# EAGLE design control (EAGLE 9.6.2)
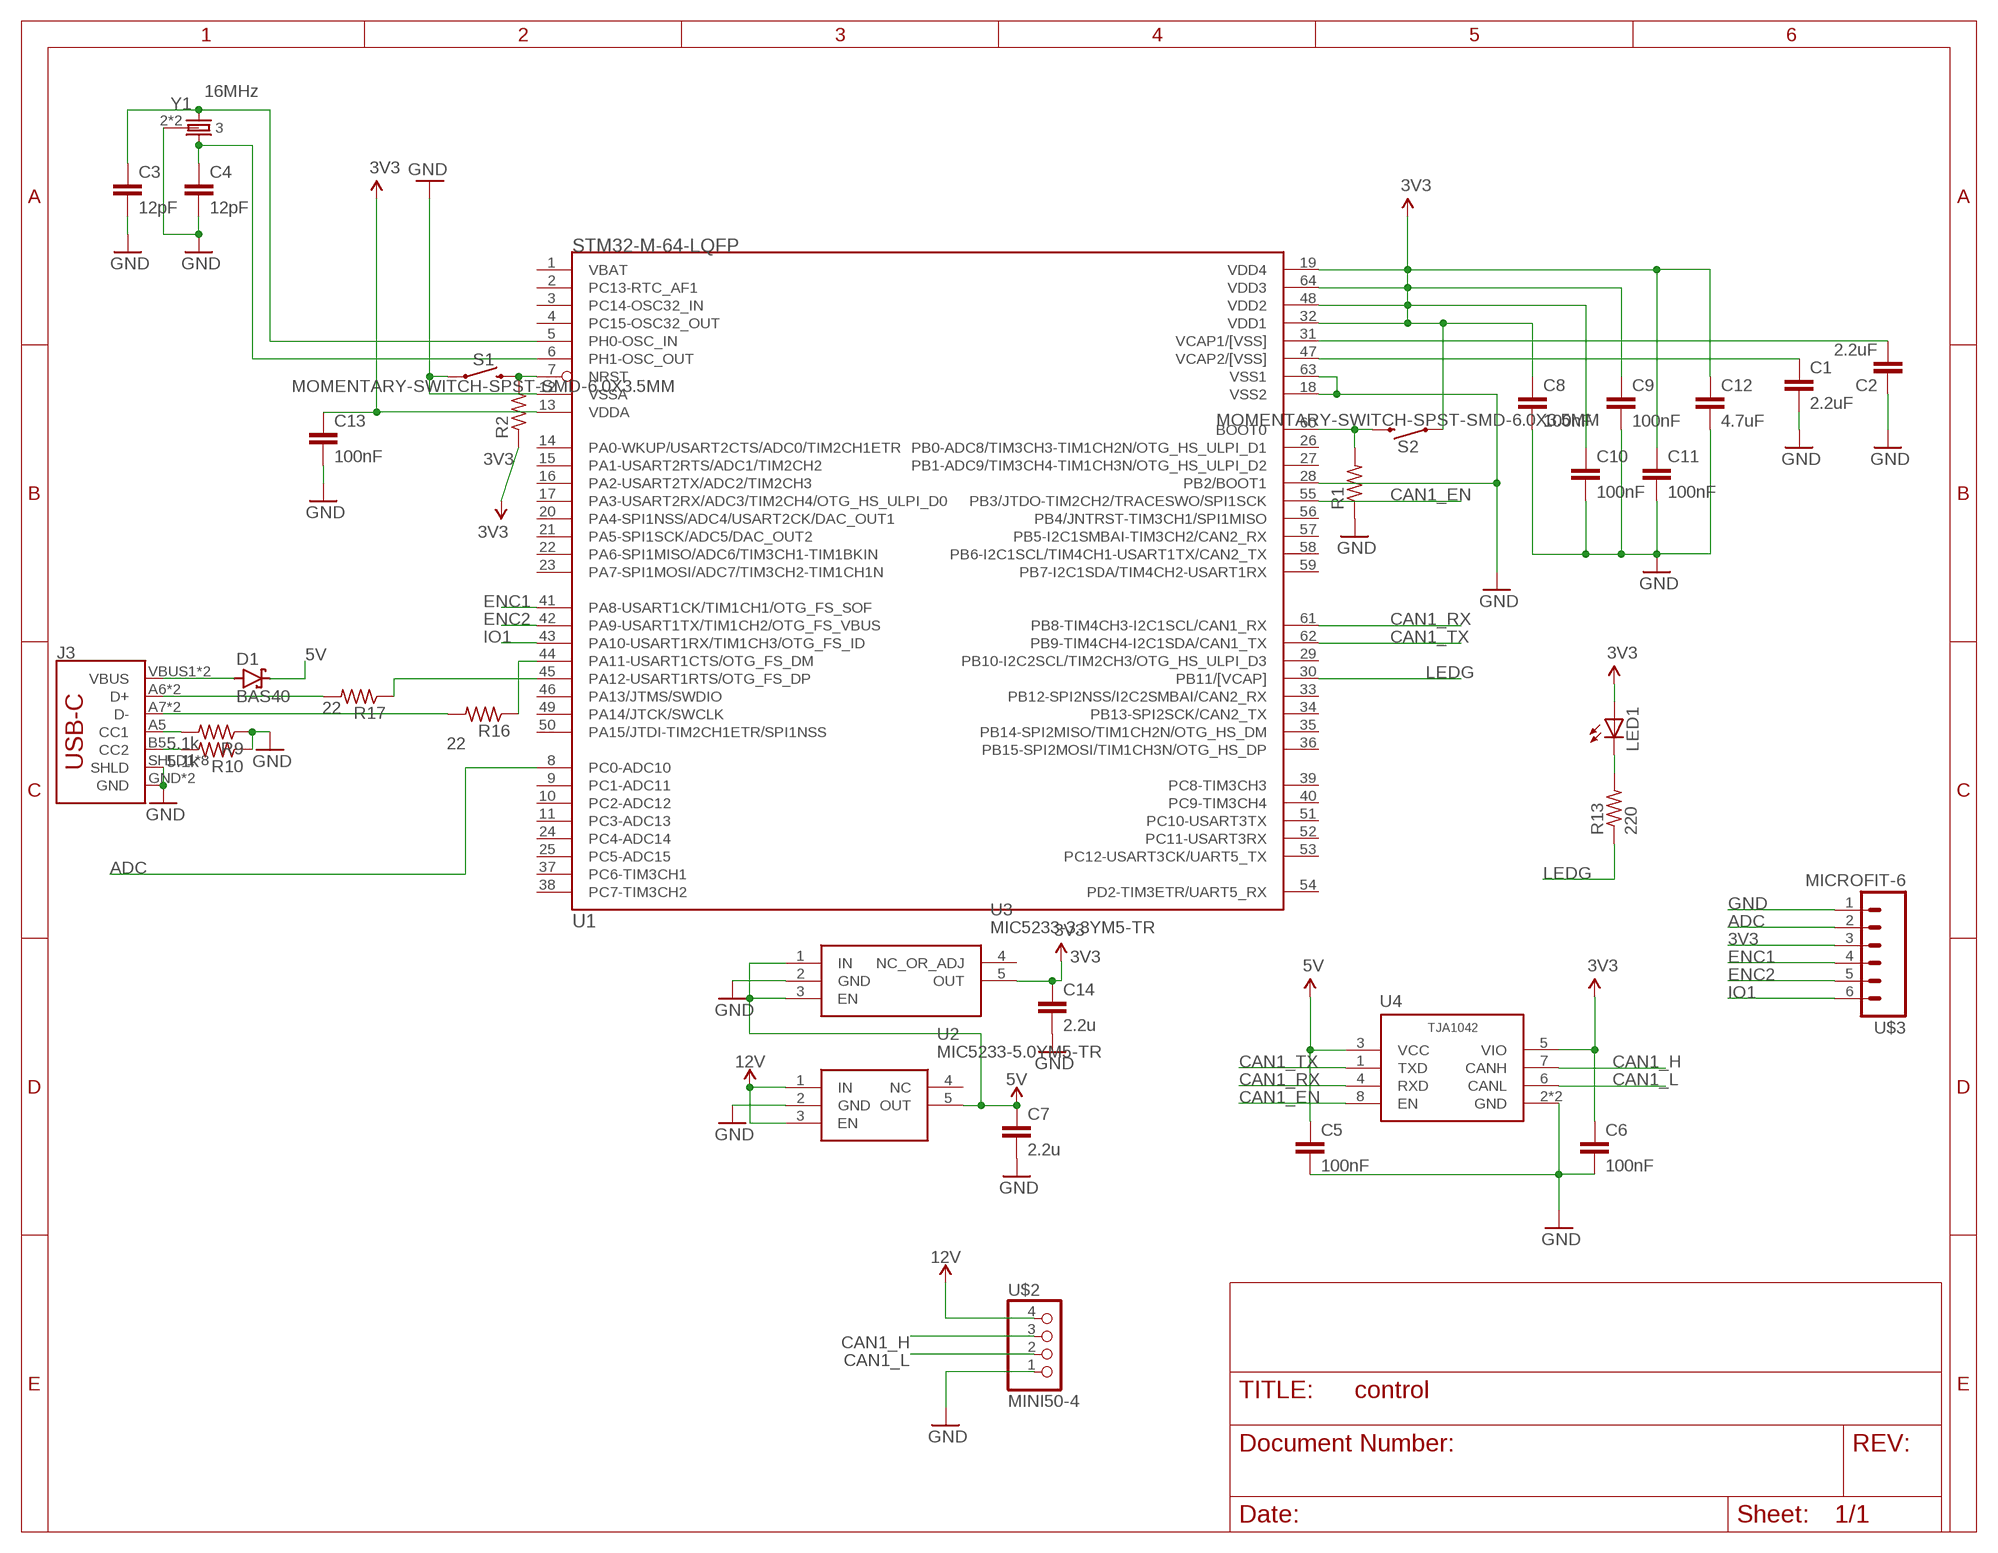
[diagram p0: schematic, sheet 1]

## Parts
C1  2.2uF  C0603  [0603-C]
C2  2.2uF  C0603  [0603-C]
C3  12pF  C0603  [0603-C]
C4  12pF  C0603  [0603-C]
C5  100nF  C0603  [0603-C]
C6  100nF  C0603  [0603-C]
C7  2.2u  C-EUC0603  [C0603]
C8  100nF  C0603  [0603-C]
C9  100nF  C0603  [0603-C]
C10  100nF  C0603  [0603-C]
C11  100nF  C0603  [0603-C]
C12  4.7uF  C0603  [0603-C]
C13  100nF  C0603  [0603-C]
C14  2.2u  C-EUC0603  [C0603]
D1  BAS40  [SOT23]
J3  USB-C-BREAKOUT_SPARKFUN-CONNECTORS_USB_C16PIN  [USB-C-BREAKOUT_SPARKFUN-CONNECTORS_USB-C-16P]
LED1  LEDCHIPLED_0805  [CHIPLED_0805]
R1  R0402  [0402-R]
R2  R0402  [0402-R]
R9  5.1k  R0402  [0402-R]
R10  5.1k  R0402  [0402-R]
R13  220  R0402  [0402-R]
R16  22  R0402  [0402-R]
R17  22  R0402  [0402-R]
S1  MOMENTARY-SWITCH-SPST-SMD-6.0X3.5MM  [TACTILE_SWITCH_SMD_6.0X3.5MM]
S2  MOMENTARY-SWITCH-SPST-SMD-6.0X3.5MM  [TACTILE_SWITCH_SMD_6.0X3.5MM]
U1  STM32-M-64-LQFP  [LQFP64]
U2  MIC5233-5.0YM5-TR  [SOT95P280X145-5N]
U3  MIC5233-3.3YM5-TR  [SOT95P280X145-5N]
U4  TJA1042HVSON  [HVSON8]
U$2  MINI50-4  [MINI50]
U$3  MICROFIT-6  [MICROFIT-6]
Y1  16MHz  CRYSTAL-3.2X2.54-PIN  [XTAL-3.2X2.5]

## Nets
3V3: C6.1 C8.1 C9.1 C10.1 C11.1 C12.1 C13.1 C14.1 LED1.A R2.1 S2.1 U1.13(VDDA) U1.19(VDD4) U1.32(VDD1) U1.48(VDD2) U1.64(VDD3) U3.5(OUT) U4.5(VIO) U$3.3
5V: C5.1 C7.1 D1.3(C) U2.5(OUT) U3.1(IN) U3.3(EN) U4.3(VCC)
12V: U2.1(IN) U2.3(EN) U$2.4
ADC: U1.8(PC0-ADC10) U$3.2
CAN1_EN: U1.55(PB3/JTDO-TIM2CH2/TRACESWO/SPI1SCK) U4.8(EN)
CAN1_H: U4.7(CANH) U$2.3
CAN1_L: U4.6(CANL) U$2.2
CAN1_RX: U1.61(PB8-TIM4CH3-I2C1SCL/CAN1_RX) U4.4(RXD)
CAN1_TX: U1.62(PB9-TIM4CH4-I2C1SDA/CAN1_TX) U4.1(TXD)
ENC1: U1.41(PA8-USART1CK/TIM1CH1/OTG_FS_SOF) U$3.4
ENC2: U1.42(PA9-USART1TX/TIM1CH2/OTG_FS_VBUS) U$3.5
GND: C1.2 C2.1 C3.2 C4.2 C5.2 C6.2 C7.2 C8.2 C9.2 C10.2 C11.2 C12.2 C13.2 C14.2 J3.GND J3.GND2(GND) J3.SHLD1(SHLD) J3.SHLD2(SHLD) J3.SHLD3(SHLD) J3.SHLD4(SHLD) J3.SHLD5(SHLD) J3.SHLD6(SHLD) J3.SHLD7(SHLD) J3.SHLD8(SHLD) R1.1 R9.1 R10.1 S1.1 U1.12(VSSA) U1.18(VSS2) U1.28(PB2/BOOT1) U1.63(VSS1) U2.2(GND) U3.2(GND) U4.2(GND) U4.PAD(GND) U$2.1 U$3.1 Y1.2 Y1.4
IO1: U1.43(PA10-USART1RX/TIM1CH3/OTG_FS_ID) U$3.6
LEDG: R13.1 U1.30(PB11/[VCAP])
N$1: C3.1 U1.5(PH0-OSC_IN) Y1.1
N$2: R16.1 U1.44(PA11-USART1CTS/OTG_FS_DM)
N$3: C4.1 U1.6(PH1-OSC_OUT) Y1.3
N$4: R17.1 U1.45(PA12-USART1RTS/OTG_FS_DP)
N$5: J3.A7(D-) J3.B7(D-) R16.2
N$6: J3.A6(D+) J3.B6(D+) R17.2
N$7: R1.2 S2.2 U1.60(BOOT0)
N$8: J3.A5(CC1) R9.2
N$9: J3.B5(CC2) R10.2
N$10: R2.2 S1.2 U1.7(NRST)
N$11: D1.1(A) J3.VBUS1(VBUS) J3.VBUS2(VBUS)
N$26: LED1.C R13.2
VCAP1: C2.2 U1.31(VCAP1/[VSS])
VCAP2: C1.1 U1.47(VCAP2/[VSS])
Unconnected: U1.1(VBAT) U1.2(PC13-RTC_AF1) U1.3(PC14-OSC32_IN) U1.4(PC15-OSC32_OUT) U1.9(PC1-ADC11) U1.10(PC2-ADC12) U1.11(PC3-ADC13) U1.14(PA0-WKUP/USART2CTS/ADC0/TIM2CH1ETR) U1.15(PA1-USART2RTS/ADC1/TIM2CH2) U1.16(PA2-USART2TX/ADC2/TIM2CH3) U1.17(PA3-USART2RX/ADC3/TIM2CH4/OTG_HS_ULPI_D0) U1.20(PA4-SPI1NSS/ADC4/USART2CK/DAC_OUT1) U1.21(PA5-SPI1SCK/ADC5/DAC_OUT2) U1.22(PA6-SPI1MISO/ADC6/TIM3CH1-TIM1BKIN) U1.23(PA7-SPI1MOSI/ADC7/TIM3CH2-TIM1CH1N) U1.24(PC4-ADC14) U1.25(PC5-ADC15) U1.26(PB0-ADC8/TIM3CH3-TIM1CH2N/OTG_HS_ULPI_D1) U1.27(PB1-ADC9/TIM3CH4-TIM1CH3N/OTG_HS_ULPI_D2) U1.29(PB10-I2C2SCL/TIM2CH3/OTG_HS_ULPI_D3) U1.33(PB12-SPI2NSS/I2C2SMBAI/CAN2_RX) U1.34(PB13-SPI2SCK/CAN2_TX) U1.35(PB14-SPI2MISO/TIM1CH2N/OTG_HS_DM) U1.36(PB15-SPI2MOSI/TIM1CH3N/OTG_HS_DP) U1.37(PC6-TIM3CH1) U1.38(PC7-TIM3CH2) U1.39(PC8-TIM3CH3) U1.40(PC9-TIM3CH4) U1.46(PA13/JTMS/SWDIO) U1.49(PA14/JTCK/SWCLK) U1.50(PA15/JTDI-TIM2CH1ETR/SPI1NSS) U1.51(PC10-USART3TX) U1.52(PC11-USART3RX) U1.53(PC12-USART3CK/UART5_TX) U1.54(PD2-TIM3ETR/UART5_RX) U1.56(PB4/JNTRST-TIM3CH1/SPI1MISO) U1.57(PB5-I2C1SMBAI-TIM3CH2/CAN2_RX) U1.58(PB6-I2C1SCL/TIM4CH1-USART1TX/CAN2_TX) U1.59(PB7-I2C1SDA/TIM4CH2-USART1RX) U2.4(NC) U3.4(NC_OR_ADJ)

## Library data of the parts
C1-C6 C8-C13 = comma.ai:C
C7 C14 = rcl:C-EU: CAPACITOR, European symbol; SPICEPREFIX: C
D1 = diode:BAS40: Silicon Schottky Diodes General-purpose diode for high-speed switching
J3 = ROTR-Wireless:USB-C-BREAKOUT_SPARKFUN-CONNECTORS_USB_C: USB Type C 16Pin Connector Super Speed pins not available on the 16-pin purely SMD connector so this part is best for USB 2.0 implementations. D1 and D2 are tied together enabling D+/- no matter which way the cable is plugged into the connector. The two channel configuration pins (CC1/2) are exposed. These are normally connected to ground via 5.1k resistors but can be reconfigured for high current/high power applications.; PROD_ID: CONN-14122
LED1 = adafruit:LED: LED OSRAM: - CHIPLED LG R971, LG N971, LY N971, LG Q971, LY Q971, LO R971, LY R971 LH N974, LH R974 LS Q976, LO Q976, LY Q976 LO Q996 - Hyper CHIPLED LW Q18S LB Q993, LB Q99A, LB R99A - SideLED LS A670, LO A670, LY A670, LG A670, LP A670 LB A673, LV A673, LT A673, LW A673 LH A674 LY A675 LS A676, LA A676, LO A676, LY A676, LW A676 LS A679, LY A679, LG A679 - Hyper Micro SIDELED® LS Y876, LA Y876, LO Y876, LY Y876 LT Y87S - SmartLED LW L88C, LW L88S LB L89C, LB L89S, LG L890 LS L89K, LO L89K, LY L89K LS L896, LA L896, LO L896, LY L896 - TOPLED LS T670, LO T670, LY T670, LG T670, LP T670 LSG T670, LSP T670, LSY T670, LOP T670, LYG T670 LG T671, LOG T671, LSG T671 LB T673, LV T673, LT T673, LW T673 LH T674 LS T676, LA T676, LO T676, LY T676, LB T676, LH T676, LSB T676, LW T676 LB T67C, LV T67C, LT T67C, LS T67K, LO T67K, LY T67K, LW E67C LS E67B, LA E67B, LO E67B, LY E67B, LB E67C, LV E67C, LT E67C LW T67C LS T679, LY T679, LG T679 LS T770, LO T770, LY T770, LG T770, LP T770 LB T773, LV T773, LT T773, LW T773 LH T774 LS E675, LA E675, LY E675, LS T675 LS T776, LA T776, LO T776, LY T776, LB T776 LHGB T686 LT T68C, LB T68C - Hyper Mini TOPLED® LB M676 - Mini TOPLED Santana® LG M470 LS M47K, LO M47K, LY M47K Source: http://www.osram.convergy.de/
R1 R2 R9 R10 R13 R16 R17 = comma.ai:R
S1 S2 = SparkFun-Switches:MOMENTARY-SWITCH-SPST: Momentary Switch (Pushbutton) - SPST Normally-open (NO) SPST momentary switches (buttons, pushbuttons). Variants PTH-12MM - 12mm square, through-hole Momentary Pushbutton Switch - 12mm Square <https://www.sparkfun.com/products/9190> (COM-09190) PTH-6.0MM, PTH-6.0MM-KIT - 6.0mm square, through-hole Mini Pushbutton Switch <https://www.sparkfun.com/products/97> (COM-00097) KIT package intended for soldering kit's - only one side of pads' copper is exposed. PTH-RIGHT-ANGLE-KIT - Right-angle, through-hole Right Angle Tactile Button <https://www.sparkfun.com/products/10791> - Used on SparkFun BigTime Watch Kit <https://www.sparkfun.com/products/11734> SMD-12MM - 12mm square, surface-mount Tactile Button - SMD (12mm) <https://www.sparkfun.com/products/12993> (COM-12993) Used on SparkFun PicoBoard <https://www.sparkfun.com/products/11888> SMD-4.5MM - 4.5mm Square Trackball Switch Used on SparkFun Blackberry Trackballer Breakout <https://www.sparkfun.com/products/13169> SMD-4.6MMX2.8MM - 4.60mm x 2.80mm, surface mount Used on SparkFun SAMD21 Mini Breakout <https://www.sparkfun.com/products/13664> SMD-5.2MM, SMD-5.2-REDUNDANT - 5.2mm square, surface-mount Mini Pushbutton Switch - SMD <https://www.sparkfun.com/products/8720> (COM-08720) Used on Arduino Pro Mini <https://www.sparkfun.com/products/11114> REDUNDANT package connects both switch circuits together SMD-6.0X3.5MM - 6.0 x 3.5mm, surface mount Momentary Reset Switch SMD <https://www.sparkfun.com/products/8229> (COM-08229) SMD-6.2MM-TALL - 6.2mm square, surface mount Tactile Button - SMD (6mm) <https://www.sparkfun.com/products/12992> Used on SparkFun Digital Sandbox <https://www.sparkfun.com/products/12651> SMD-RIGHT-ANGLE - Right-angle, surface mount Used on SparkFun Block for Intel® Edison - Arduino <https://www.sparkfun.com/products/13036>; PROD_ID: SWCH-00815; SF_SKU: COM-08229
U1 = comma.ai:STM32-M-64-LQFP: STM32F103 Medium Density 64pin LQFP
U2 = SamacSys_Parts:MIC5233-5.0YM5-TR: MICROCHIP - MIC5233-5.0YM5-TR - LDO, REG, 36VIN, 0.1A, 5V, 2%, 5SOT23 Source: Datasheet <https://componentsearchengine.com/Datasheets/2/MIC5233-5.0YM5-TR.pdf>; DESCRIPTION: MICROCHIP - MIC5233-5.0YM5-TR - LDO, REG, 36VIN, 0.1A, 5V, 2%, 5SOT23; HEIGHT: 1.45mm; MANUFACTURER_NAME: Microchip; MANUFACTURER_PART_NUMBER: MIC5233-5.0YM5-TR; MOUSER_PART_NUMBER: 998-MIC5233-5.0YM5TR; MOUSER_PRICE-STOCK: https://www.mouser.co.uk/ProductDetail/Microchip-Technology-Micrel/MIC5233-50YM5-TR?qs=U6T8BxXiZAWSnpCHgrMajw%3D%3D
U3 = SamacSys_Parts:MIC5233-3.3YM5-TR: High Input Voltage Low IQ UCAP LDO Regulator Source: Datasheet <http://ww1.microchip.com/downloads/en/DeviceDoc/MIC5233-Data-Sheet-DS20006033D.pdf>; DESCRIPTION: High Input Voltage Low IQ UCAP LDO Regulator; HEIGHT: 1.45mm; MANUFACTURER_NAME: Microchip; MANUFACTURER_PART_NUMBER: MIC5233-3.3YM5-TR; MOUSER_PART_NUMBER: 998-MIC5233-3.3YM5TR; MOUSER_PRICE-STOCK: https://www.mouser.co.uk/ProductDetail/Microchip-Technology-Micrel/MIC5233-33YM5-TR?qs=U6T8BxXiZAWDhshLMgpaLQ%3D%3D
U4 = comma.ai:TJA1042
U$2 = interceptor:MINI50-4
U$3 = interceptor:MICROFIT-6
Y1 = comma.ai:CRYSTAL-3.2X2.5

## Board
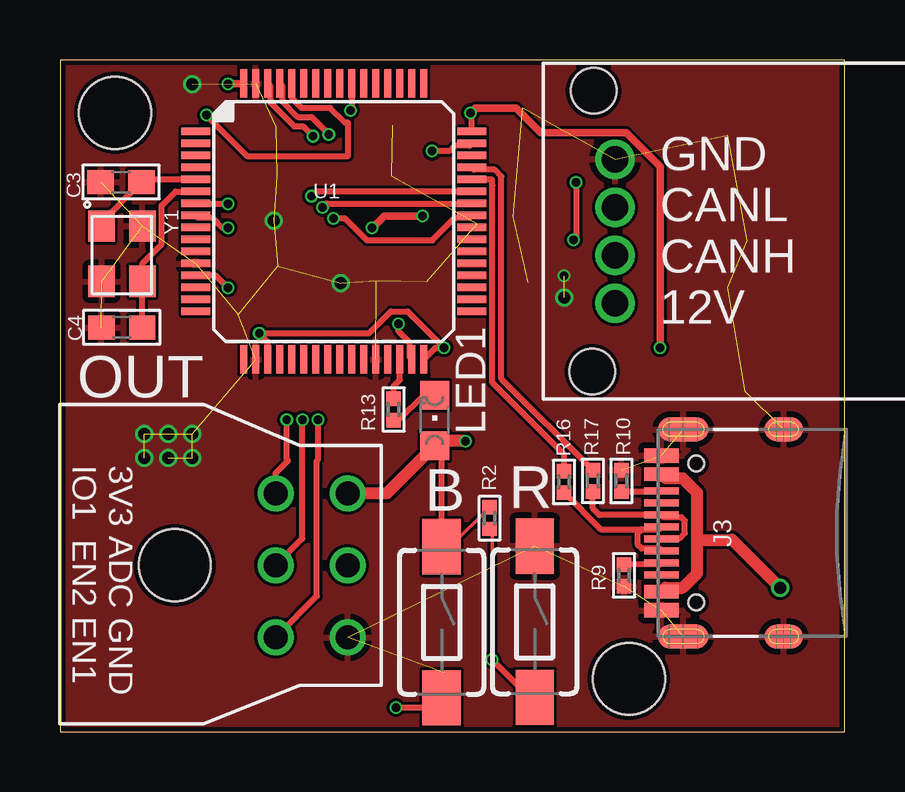
[diagram p1: board, top side]
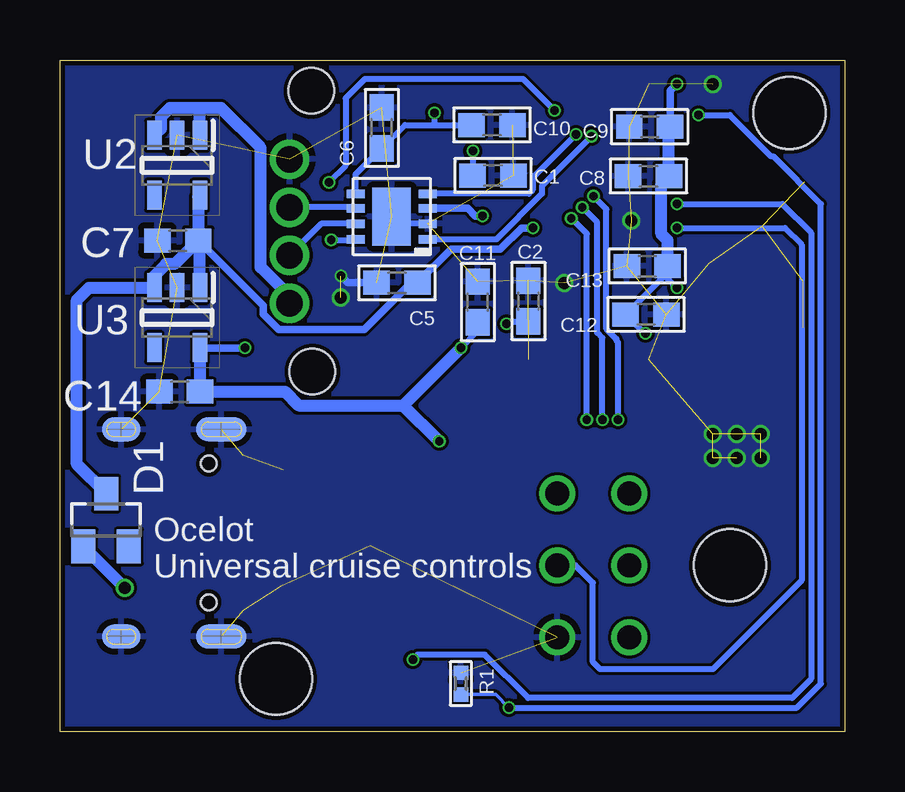
[diagram p2: board, bottom side, seen from below]

Size 32.7 x 28 mm. Coordinates in mm from the lower left corner, seen from the top.
Outline: 0,0 32.7,0 32.7,28 0,28 0,0
Copper layers (1*16): Top 0.035559375mm / dielectric 1.6mm / Bottom 0.035559375mm
Design rules "jlcpcb2layer": minimum track width 5mil, minimum drill 12mil, track to track 5mil, track to pad 5mil, pad to pad 5mil, via to via 5mil, smd to smd 5mil, copper to edge 8mil, drill to drill 6mil, minimum pad ring 5mil, minimum via ring 3mil, stop-mask expansion 2.5mil, vias tented up to drill 0mil, thermal gap 10mil
Holes 3 mm at 23.7,2.2 2.3,25.8

### Footprints (pad centres in the part's own frame; a part is rotated, then mirrored left to right if it is on the bottom)
0603-C = smd 1.1 x 1: 1 -0.85,0; 2 0.85,0
C0603 = smd 1.1 x 1: 1 -0.85,0; 2 0.85,0
SOT23 = smd 1 x 1.4: 1 -0.95,-1.1; 2 0.95,-1.1; 3 0,1.1
USB-C-BREAKOUT_SPARKFUN-CONNECTORS_USB-C-16P = smd 0.3 x 1.45: A5 -1.25,0; A6 -0.25,0; A7 0.25,0; A8 1.25,0; B5 1.75,0; B6 0.75,0; B7 -0.75,0; B8 -1.75,0 | smd 0.6 x 1.45: GND -3.225,0; GND2 3.225,0 | smd 1 x 2.1: SHLD1 -4.32,-0.915; SHLD2 4.32,-0.915 | smd 1 x 2.1 bottom: SHLD3 -4.32,-0.915; SHLD4 4.32,-0.915 | smd 1 x 1.6: SHLD5 -4.32,-5.095; SHLD8 4.32,-5.095 | smd 1 x 1.6 bottom: SHLD6 -4.32,-5.095; SHLD7 4.32,-5.095 | smd 0.55 x 1.45: VBUS1 -2.45,0; VBUS2 2.45,0 | hole 0.65: -2.89,-1.445; 2.89,-1.445
CHIPLED_0805 = smd 1.2 x 1.2: A 0,-1.05; C 0,1.05
0402-R = smd 0.6 x 0.6: 1 -0.45,0; 2 0.45,0
TACTILE_SWITCH_SMD_6.0X3.5MM = smd 2.3 x 1.6: 1 -3.15,0; 2 3.15,0
LQFP64 = smd 1.2 x 0.3: 1 -5.75,3.75; 2 -5.75,3.25; 3 -5.75,2.75; 4 -5.75,2.25; 5 -5.75,1.75; 6 -5.75,1.25; 7 -5.75,0.75; 8 -5.75,0.25; 9 -5.75,-0.25; 10 -5.75,-0.75; 11 -5.75,-1.25; 12 -5.75,-1.75; 13 -5.75,-2.25; 14 -5.75,-2.75; 15 -5.75,-3.25; 16 -5.75,-3.75; 33 5.75,-3.75; 34 5.75,-3.25; 35 5.75,-2.75; 36 5.75,-2.25; 37 5.75,-1.75; 38 5.75,-1.25; 39 5.75,-0.75; 40 5.75,-0.25; 41 5.75,0.25; 42 5.75,0.75; 43 5.75,1.25; 44 5.75,1.75; 45 5.75,2.25; 46 5.75,2.75; 47 5.75,3.25; 48 5.75,3.75 | smd 0.3 x 1.2: 17 -3.75,-5.75; 18 -3.25,-5.75; 19 -2.75,-5.75; 20 -2.25,-5.75; 21 -1.75,-5.75; 22 -1.25,-5.75; 23 -0.75,-5.75; 24 -0.25,-5.75; 25 0.25,-5.75; 26 0.75,-5.75; 27 1.25,-5.75; 28 1.75,-5.75; 29 2.25,-5.75; 30 2.75,-5.75; 31 3.25,-5.75; 32 3.75,-5.75; 49 3.75,5.75; 50 3.25,5.75; 51 2.75,5.75; 52 2.25,5.75; 53 1.75,5.75; 54 1.25,5.75; 55 0.75,5.75; 56 0.25,5.75; 57 -0.25,5.75; 58 -0.75,5.75; 59 -1.25,5.75; 60 -1.75,5.75; 61 -2.25,5.75; 62 -2.75,5.75; 63 -3.25,5.75; 64 -3.75,5.75
SOT95P280X145-5N = smd 1.2 x 0.6: 1 -1.25,0.95; 2 -1.25,0; 3 -1.25,-0.95; 4 1.25,-0.95; 5 1.25,0.95
HVSON8 = smd 0.75 x 0.35: 1 -1.5,0.95; 2 -1.5,0.3; 3 -1.5,-0.35; 4 -1.5,-0.95; 5 1.5,-0.95; 6 1.5,-0.35; 7 1.5,0.3; 8 1.5,0.95 | smd 1.6 x 2.4: PAD 0,0
MINI50 = drill 1.1: 1 0,0; 2 2,0; 3 4,0; 4 6,0 | hole 1.9: -2.85,-0.9; 8.85,-0.95
MICROFIT-6 = drill 1: 1 3,0; 2 0,0; 3 -3,0; 4 3,-3; 5 0,-3; 6 -3,-3 | hole 3: 0,-7.2
XTAL-3.2X2.5 = smd 1.3 x 1.1: 1 0,-1.8; 2 2.3,-1.8; 3 2.3,-0.1; 4 0,-0.1

### Placement (x,y rotation side)
C1  14.66,23.18 0 bottom
C2  13.18,17.95 270 bottom
C3  2.54,22.91 180 top
C4  2.58,16.85 180 top
C5  18.66,18.71 180 bottom
C6  19.29,25.17 90 bottom
C7  27.79,20.47 180 bottom
C8  8.18,23.16 180 bottom
C9  8.13,25.22 180 bottom
C10  14.7,25.29 0 bottom
C11  15.29,17.91 90 bottom
C12  8.28,17.39 0 bottom
C13  8.23,19.41 180 bottom
C14  27.71,14.17 180 bottom
D1  30.78,8.82 0 bottom
J3  25.06,8.28 90 top
LED1  15.61,12.97 0 top
R1  16,2 270 bottom
R2  17.9,8.9 270 top
R9  23.5,6.51 90 top
R10  23.39,10.45 270 top
R13  13.9,13.43 270 top
R16  21,10.41 270 top
R17  22.2,10.45 270 top
S1  19.78,4.58 270 top
S2  15.9,4.56 270 top
U1  11.41,21.27 0 top
U2  27.82,23.61 270 bottom
U3  27.82,17.26 270 bottom
U4  18.88,21.47 180 bottom
U$2  23.13,23.86 270 top
U$3  11.98,6.93 270 top
Y1  3.53,21.07 270 top

### Tracks (layer width: path | path; a pad name or v marks a point on that pad's centre or on a via)
3V3  (via drill 0.35)
  Top 0.152: R2.1 16.26,7.71 S2.1
  Top 0.254: U1.48 17.16,25.74 v17.1,25.8 | U1.19 8.66,16.25 v8.3,16.61 12.88,16.61 13.79,17.52 14.48,17.52 v16,16 15.64,16 U1.32 | v7,18.5 6.48,19.02 U1.13 | S2.1 15.9,11.63 LED1.A
  Top 0.305: v25,16 25,23.55 23.59,24.96 20.04,24.96 19,26 17.3,26 v17.1,25.8 | v7,27 7.02,27.02 U1.64
  Top 0.508: U$3.3 13.62,9.93 LED1.A 15.8,12.11 v16.9,12.11
  Bottom 0.254: U4.5 20.38,23.23 C6.1 18.32,25.29 17.1,25.29 | 17.1,25.29 C10.1 | v17.1,25.8 17.1,25.29 | v8.3,16.61 8.35,16.61 C12.1 7.38,19.14 C13.1 7.38,18.88 v7,18.5 | v16,16 15.29,16.71 C11.1
  Bottom 0.305: U3.5 v25,16 | C9.1 7.28,26.72 v7,27
  Bottom 0.508: U3.5 C14.1 23.33,14.17 22.76,13.6 18.4,13.6 | C13.1 7.38,20.47 7.64,20.73 7.64,22.84 C8.1 7.33,25.17 C9.1 | 18.4,13.6 v16,16 | 18.4,13.6 v16.9,12.11
5V  (via drill 0.35)
  Top 0.305: v13,21 13.5,21.5 v15.1,21.5
  Bottom 0.305: C7.1 24.23,17.76 24.23,17.4 23.59,16.76 20.02,16.76 18.07,18.71 C5.1 16.41,20.11 14.35,20.11 13.47,21 v13,21 | v15.1,21.5 15.4,21.5 15.72,21.82 U4.3
  Bottom 0.508: U2.5 26.94,22.29 C7.1 | C7.1 27.92,19.49 28.28,19.49 28.77,19 U3.3 31.49,18.51 32,18 32,11.14 D1.3 | U3.1 26.87,20.4 C7.1
12V
  Bottom 0.508: U$2.4 23.13,18.15 24.34,19.36 24.34,24.34 26,26 27,26 | U2.3 28.5,25.13 28.5,25.62 28.12,26 27,26 | U2.1 26.87,25.87 27,26
ADC  (via drill 0.35)
  Top 0.254: U1.8 5.76,21.42 6.37,21.42 6.79,21 v7,21
  Bottom 0.254: v7,21 2.5,21 1.8,20.3 1.8,6.3 5.5,2.6 10.2,2.6 10.5,2.9 10.5,6.2 11.23,6.93 U$3.2
CAN1_EN  (via drill 0.35)
  Top 0.254: U1.55 12.16,25.96 v12.1,25.9 | v21.5,22.9 21.5,20.6 v21.4,20.5
  Bottom 0.254: v12.1,25.9 13.4,27.2 20,27.2 20.8,26.4 20.8,23.6 v21.5,22.9 | v21.4,20.5 20.4,20.5 U4.8
CAN1_H
  Bottom 0.254: U4.7 21.82,21.17 U$2.3
CAN1_L
  Bottom 0.254: U4.6 20.42,21.86 U$2.2
CAN1_RX  (via drill 0.35)
  Top 0.254: U1.61 9.26,26.92 9.26,26.28 9.91,25.62 10.48,25.62 v11.2,24.9
  Bottom 0.254: v11.2,24.9 13.01,23.09 13.01,22.58 13.16,22.42 U4.4
CAN1_TX  (via drill 0.35)
  Top 0.254: U1.62 8.76,26.92 8.76,26.24 9.76,25.24 10.13,25.24 v10.55,24.82
  Bottom 0.254: v10.55,24.82 12.62,22.74 12.62,22.42 14.52,20.52 U4.1
ENC1  (via drill 0.35)
  Top 0.254: U$3.4 10.7,5.65 10.7,11.3 10.75,11.35 v10.75,13 | U1.41 17.06,21.42 16.45,21.42 15.51,20.48 12.79,20.48 11.87,21.4 v11.4,21.4
  Bottom 0.254: v10.75,13 10.75,20.75 v11.4,21.4
ENC2  (via drill 0.35)
  Top 0.254: U$3.5 10.1,8.05 v10.1,13 | v10.94,21.86 11.1,22.02 U1.42
  Bottom 0.254: v10.1,13 10.1,16.41 10.31,16.63 10.31,21.24 v10.94,21.86
GND  (via drill 0.35, 0.5)  (41 unrouted)
  Bottom 0.254: U4.2 18.58,21.17 U4.PAD
  Bottom 0.305: C5.2 20.71,18.71 v21,19
  other vias: 3.5,12.4 4.5,12.4 5.5,12.4 5.5,11.4 4.5,11.4 3.5,11.4 8.9,21.3 11.7,18.7 5.5,27 21,18.1
  pour Top: 0,0 0,28 32.7,28 32.7,0
  pour Bottom: 0,0 0,28 32.7,28 32.7,0
IO1  (via drill 0.35)
  Top 0.254: U$3.6 8.98,10.78 9.5,11.3 9.45,11.35 v9.45,13 | U1.43 10.68,22.52 v10.48,22.32
  Bottom 0.254: v10.48,22.32 9.93,21.78 9.93,16.78 9.52,16.37 9.52,16.3 9.45,16.23 v9.45,13
LEDG
  Top 0.254: R13.1 13.9,14.4 14.16,14.66 U1.30
N$1
  Top 0.254: U1.5 3.5,23.02 C3.1 1.73,21.25 Y1.1
N$2
  Top 0.254: R16.1 21,11.56 18.01,14.55 18.01,22.77 18,22.79 18,23 17.98,23.02 U1.44
N$3
  Top 0.254: U1.6 4.82,22.52 4.23,21.93 4.23,20.31 3.43,19.51 Y1.3 C4.1
N$4
  Top 0.254: U1.45 17.26,23.42 18.11,23.42 18.39,23.14 18.39,14.7 R17.1
N$5
  Top 0.254: 24.23,8.43 24.08,8.29 24.08,7.77 24.23,7.63 24.96,7.63 J3.B7 | 24.23,8.43 24.96,8.43 J3.A7 | R16.2 22.53,8.43 24.23,8.43
N$6
  Top 0.254: J3.A6 25.08,8.05 25.82,8.05 26.04,8.27 26.04,8.79 25.89,8.93 25.16,8.93 J3.B6 22.47,9.03 22.2,9.3 R17.2
N$7  (via drill 0.35)
  Top 0.254: S2.2 15.49,1 v14,1 | v6.1,25.7 7.8,24 12,24 12,25.38 11.89,25.38 11.27,26 10.07,26 9.66,26.41 U1.60
  Bottom 0.152: v14,1 14.55,1.55 R1.2
  Bottom 0.254: v14,1 2,1 1,2 1,22 2.97,23.97 3.06,23.97 4.79,25.7 v6.1,25.7
N$8
  Top 0.254: J3.A5 24.99,6.96 R9.2
N$9
  Top 0.254: J3.B5 25.03,10 R10.2
N$10  (via drill 0.35)
  Top 0.152: R2.2 18,8.35 v18,3
  Top 0.254: U1.7 6.98,22.02 v7,22 | v18,3 19.57,1.43 S1.2
  Bottom 0.254: v7,22 2.6,22 1.4,20.8 1.4,2.2 2.2,1.4 13.2,1.4 15,3.2 17.8,3.2 v18,3
N$11  (via drill 0.5)
  Top 0.508: J3.VBUS1 25.23,6 25.94,6 26.55,6.6 26.55,8 | J3.VBUS2 25.23,10.56 25.94,10.56 26.55,9.96 26.55,8 | 26.55,8 28,8 v30,6
  Bottom 0.508: v30,6 v30.01,6 D1.1
N$26
  Top 0.254: LED1.C 15.14,14.02 14.1,12.98 R13.2
VCAP1  (via drill 0.35)
  Top 0.254: U1.31 14.56,15.62 14.56,16.23 14.1,16.69 v14.1,17
  Bottom 0.254: v14.1,17 14,17.1 C2.2
VCAP2  (via drill 0.35)
  Top 0.254: U1.47 17.06,24.42 16.45,24.42 16.23,24.2 v15.5,24.2
  Bottom 0.254: v15.5,24.2 v15.51,24.19 C1.1

### Text on the board
tNames: GND / CANL / CANH / 12V | OUT | 3V3 ADC GND / IO1 EN2 EN1 | B | R
bNames: Ocelot / Universal cruise controls